# EAGLE design edgesata-v2 (EAGLE 6.4)
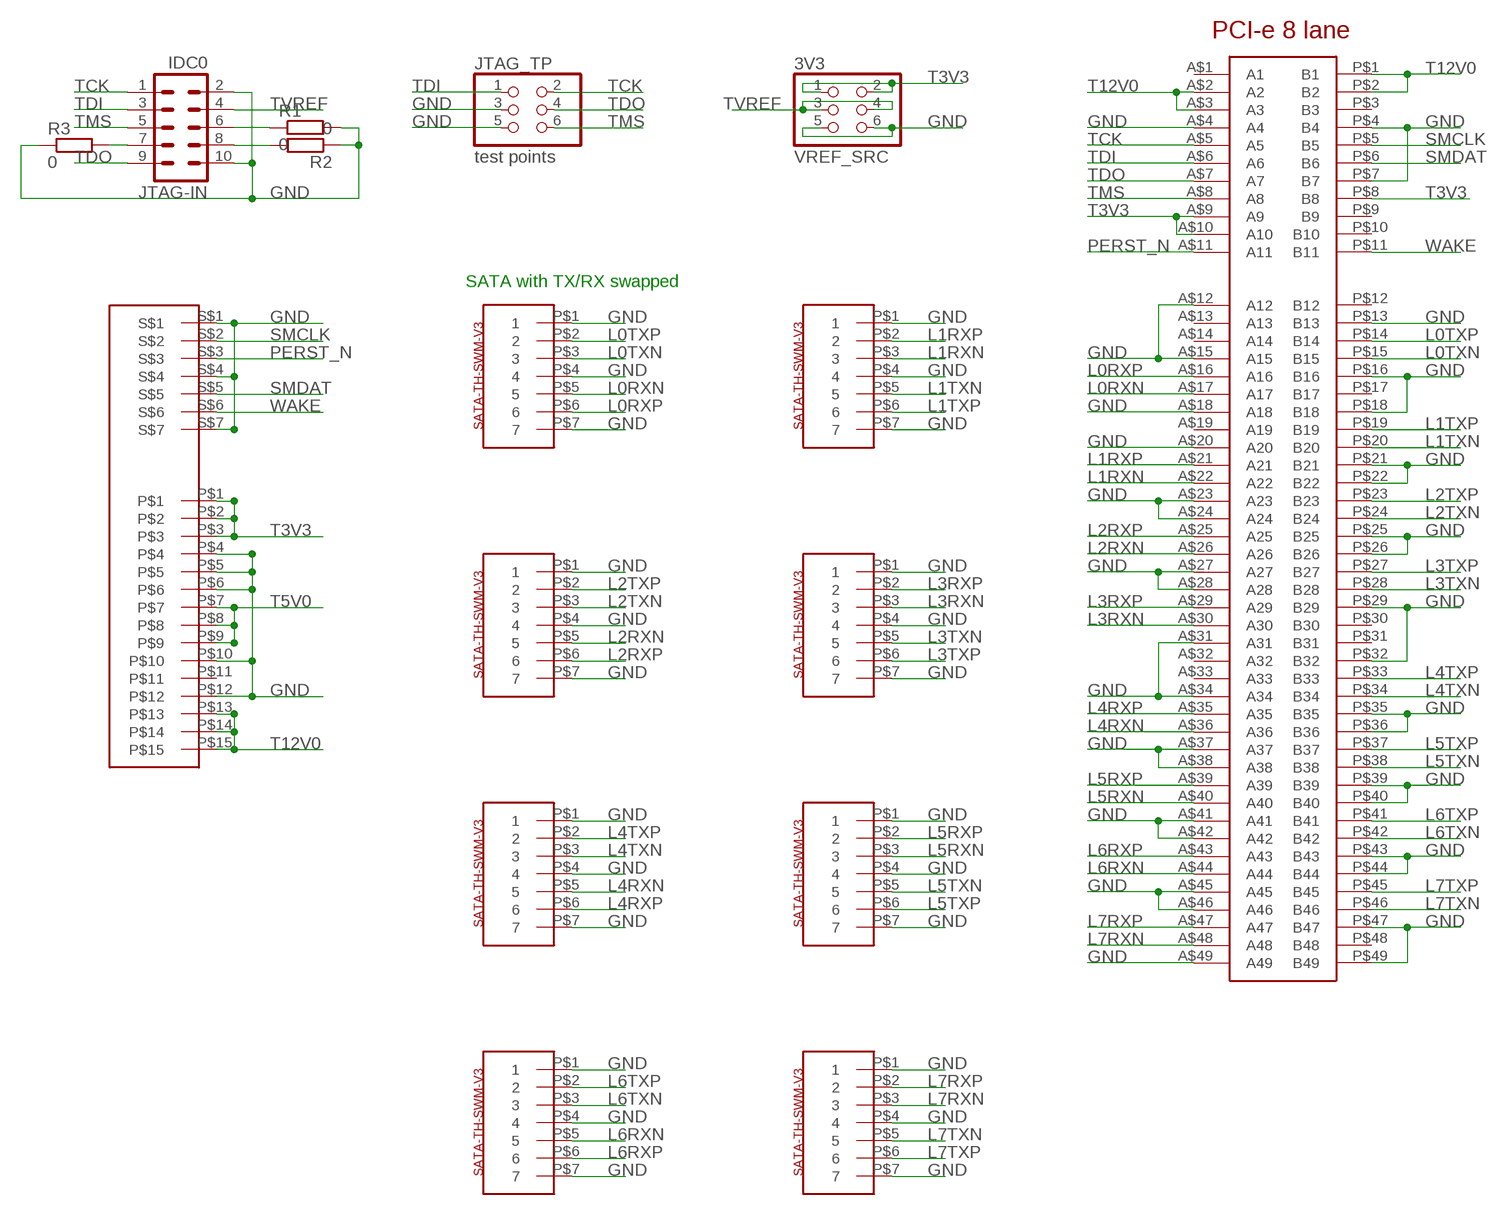
[diagram p0: schematic, sheet 1]

## Parts
3V3  VREF_SRC  PINHD-2X3  [2X03]
JTAG-IN  IDC0  MA05-2  [MA05-2]
JTAG_TP  test points  PINHD-2X3  [2X03]
LANE0  SATA-TH-SWM-V3  [SATA-TH-SWM-V3]
LANE1  SATA-TH-SWM-V3  [SATA-TH-SWM-V3]
LANE2  SATA-TH-SWM-V3  [SATA-TH-SWM-V3]
LANE3  SATA-TH-SWM-V3  [SATA-TH-SWM-V3]
LANE4  SATA-TH-SWM-V3  [SATA-TH-SWM-V3]
LANE5  SATA-TH-SWM-V3  [SATA-TH-SWM-V3]
LANE6  SATA-TH-SWM-V3  [SATA-TH-SWM-V3]
LANE7  SATA-TH-SWM-V3  [SATA-TH-SWM-V3]
R1  0  R-EU_R0805W  [R0805W]
R2  0  R-EU_R0805W  [R0805W]
R3  0  R-EU_R0805W  [R0805W]
U$1  SATA-POWER-V1  [SATA-POWER-V1]
U$8  PCIE-EDGE-8LANE-V1  [PCIE-EDGE-8LANE-V1]

## Nets
GND: 3V3.5 3V3.6 JTAG-IN.2 JTAG-IN.10 JTAG_TP.3 JTAG_TP.5 LANE0.P$1 LANE0.P$4 LANE0.P$7 LANE1.P$1 LANE1.P$4 LANE1.P$7 LANE2.P$1 LANE2.P$4 LANE2.P$7 LANE3.P$1 LANE3.P$4 LANE3.P$7 LANE4.P$1 LANE4.P$4 LANE4.P$7 LANE5.P$1 LANE5.P$4 LANE5.P$7 LANE6.P$1 LANE6.P$4 LANE6.P$7 LANE7.P$1 LANE7.P$4 LANE7.P$7 R1.2 R2.1 R3.1 U$1.P$4 U$1.P$5 U$1.P$6 U$1.P$10 U$1.P$12 U$1.S$1 U$1.S$4 U$1.S$7 U$8.A$4(A4) U$8.A$12(A12) U$8.A$15(A15) U$8.A$18(A18) U$8.A$20(A20) U$8.A$23(A23) U$8.A$24(A24) U$8.A$27(A27) U$8.A$28(A28) U$8.A$31(A31) U$8.A$34(A34) U$8.A$37(A37) U$8.A$38(A38) U$8.A$41(A41) U$8.A$42(A42) U$8.A$45(A45) U$8.A$46(A46) U$8.A$49(A49) U$8.P$4(B4) U$8.P$7(B7) U$8.P$13(B13) U$8.P$16(B16) U$8.P$18(B18) U$8.P$21(B21) U$8.P$22(B22) U$8.P$25(B25) U$8.P$26(B26) U$8.P$29(B29) U$8.P$32(B32) U$8.P$35(B35) U$8.P$36(B36) U$8.P$39(B39) U$8.P$40(B40) U$8.P$43(B43) U$8.P$44(B44) U$8.P$47(B47) U$8.P$49(B49)
L0RXN: LANE0.P$5 U$8.A$17(A17)
L0RXP: LANE0.P$6 U$8.A$16(A16)
L0TXN: LANE0.P$3 U$8.P$15(B15)
L0TXP: LANE0.P$2 U$8.P$14(B14)
L1RXN: LANE1.P$3 U$8.A$22(A22)
L1RXP: LANE1.P$2 U$8.A$21(A21)
L1TXN: LANE1.P$5 U$8.P$20(B20)
L1TXP: LANE1.P$6 U$8.P$19(B19)
L2RXN: LANE2.P$5 U$8.A$26(A26)
L2RXP: LANE2.P$6 U$8.A$25(A25)
L2TXN: LANE2.P$3 U$8.P$24(B24)
L2TXP: LANE2.P$2 U$8.P$23(B23)
L3RXN: LANE3.P$3 U$8.A$30(A30)
L3RXP: LANE3.P$2 U$8.A$29(A29)
L3TXN: LANE3.P$5 U$8.P$28(B28)
L3TXP: LANE3.P$6 U$8.P$27(B27)
L4RXN: LANE4.P$5 U$8.A$36(A36)
L4RXP: LANE4.P$6 U$8.A$35(A35)
L4TXN: LANE4.P$3 U$8.P$34(B34)
L4TXP: LANE4.P$2 U$8.P$33(B33)
L5RXN: LANE5.P$3 U$8.A$40(A40)
L5RXP: LANE5.P$2 U$8.A$39(A39)
L5TXN: LANE5.P$5 U$8.P$38(B38)
L5TXP: LANE5.P$6 U$8.P$37(B37)
L6RXN: LANE6.P$5 U$8.A$44(A44)
L6RXP: LANE6.P$6 U$8.A$43(A43)
L6TXN: LANE6.P$3 U$8.P$42(B42)
L6TXP: LANE6.P$2 U$8.P$41(B41)
L7RXN: LANE7.P$3 U$8.A$48(A48)
L7RXP: LANE7.P$2 U$8.A$47(A47)
L7TXN: LANE7.P$5 U$8.P$46(B46)
L7TXP: LANE7.P$6 U$8.P$45(B45)
N$1: JTAG-IN.7 R3.2
N$3: JTAG-IN.6 R1.1
N$5: JTAG-IN.8 R2.2
PERST_N: U$1.S$3 U$8.A$11(A11)
SMCLK: U$1.S$2 U$8.P$5(B5)
SMDAT: U$1.S$5 U$8.P$6(B6)
T3V3: 3V3.1 3V3.2 U$1.P$1 U$1.P$2 U$1.P$3 U$8.A$9(A9) U$8.A$10(A10) U$8.P$8(B8)
T5V0: U$1.P$7 U$1.P$8 U$1.P$9
T12V0: U$1.P$13 U$1.P$14 U$1.P$15 U$8.A$2(A2) U$8.A$3(A3) U$8.P$1(B1) U$8.P$2(B2)
TCK: JTAG-IN.1 JTAG_TP.2 U$8.A$5(A5)
TDI: JTAG-IN.3 JTAG_TP.1 U$8.A$6(A6)
TDO: JTAG-IN.9 JTAG_TP.4 U$8.A$7(A7)
TMS: JTAG-IN.5 JTAG_TP.6 U$8.A$8(A8)
TVREF: 3V3.3 3V3.4 JTAG-IN.4
WAKE: U$1.S$6 U$8.P$11(B11)
Unconnected: U$1.P$11 U$8.A$1(A1) U$8.A$13(A13) U$8.A$14(A14) U$8.A$19(A19) U$8.A$32(A32) U$8.A$33(A33) U$8.P$3(B3) U$8.P$9(B9) U$8.P$10(B10) U$8.P$12(B12) U$8.P$17(B17) U$8.P$30(B30) U$8.P$31(B31) U$8.P$48(B48)

## Notes on the sheet
- SATA with TX/RX swapped

## Library data of the parts
3V3 JTAG_TP = pinhead:PINHD-2X3: PIN HEADER
JTAG-IN = con-lstb:MA05-2: PIN HEADER
LANE0 LANE1-LANE7 = SATA-TH-SWM-V2:SATA-TH-SWM-V3
R1-R3 = rcl:R-EU_: RESISTOR, European symbol
U$1 = SATA-TH-SWM-V2:SATA-POWER-V1: SATA with power
U$8 = SATA-TH-SWM-V2:PCIE-EDGE-8LANE-V1

## Board
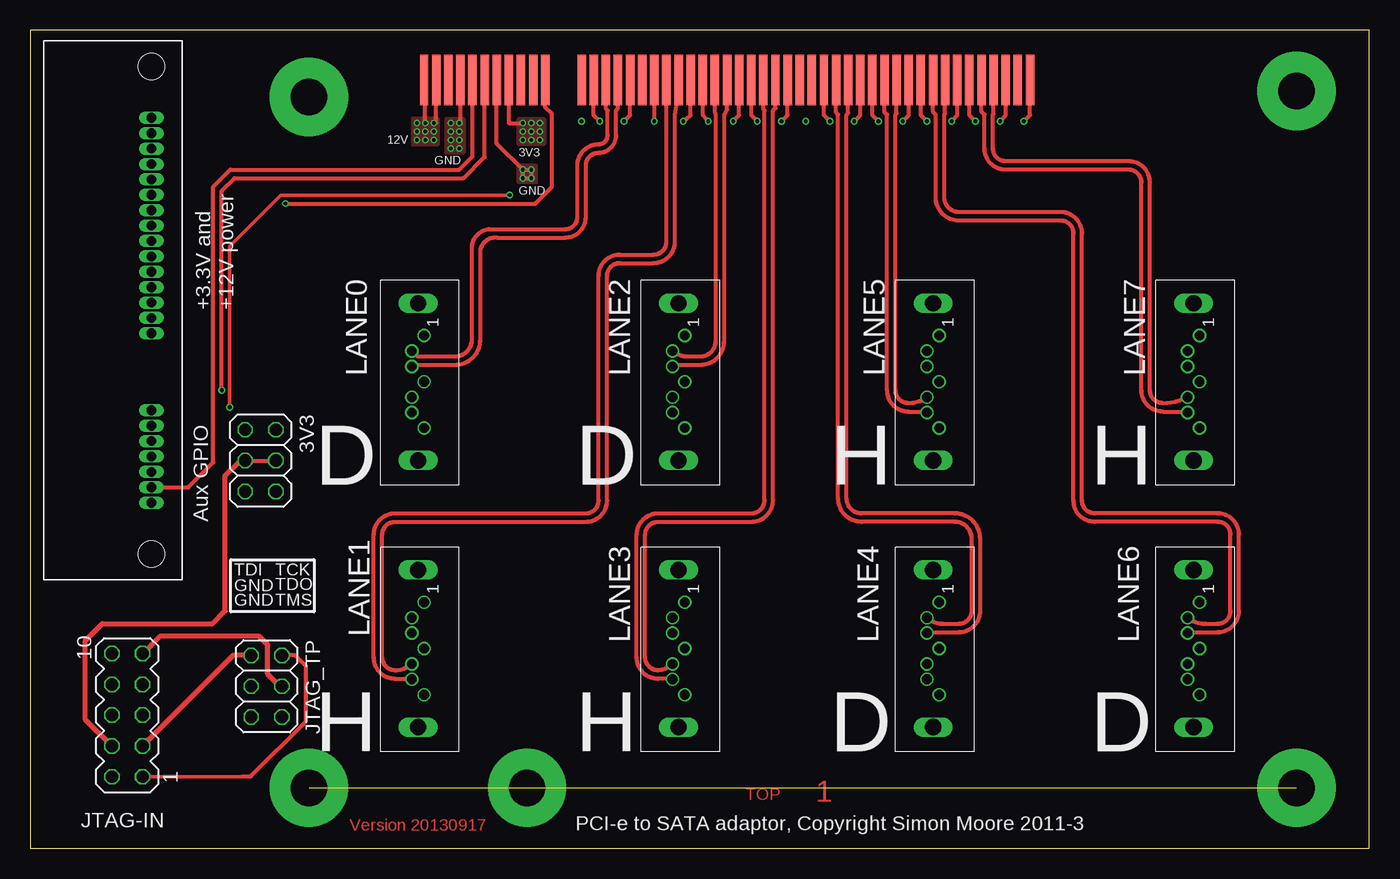
[diagram p1: board, top side]
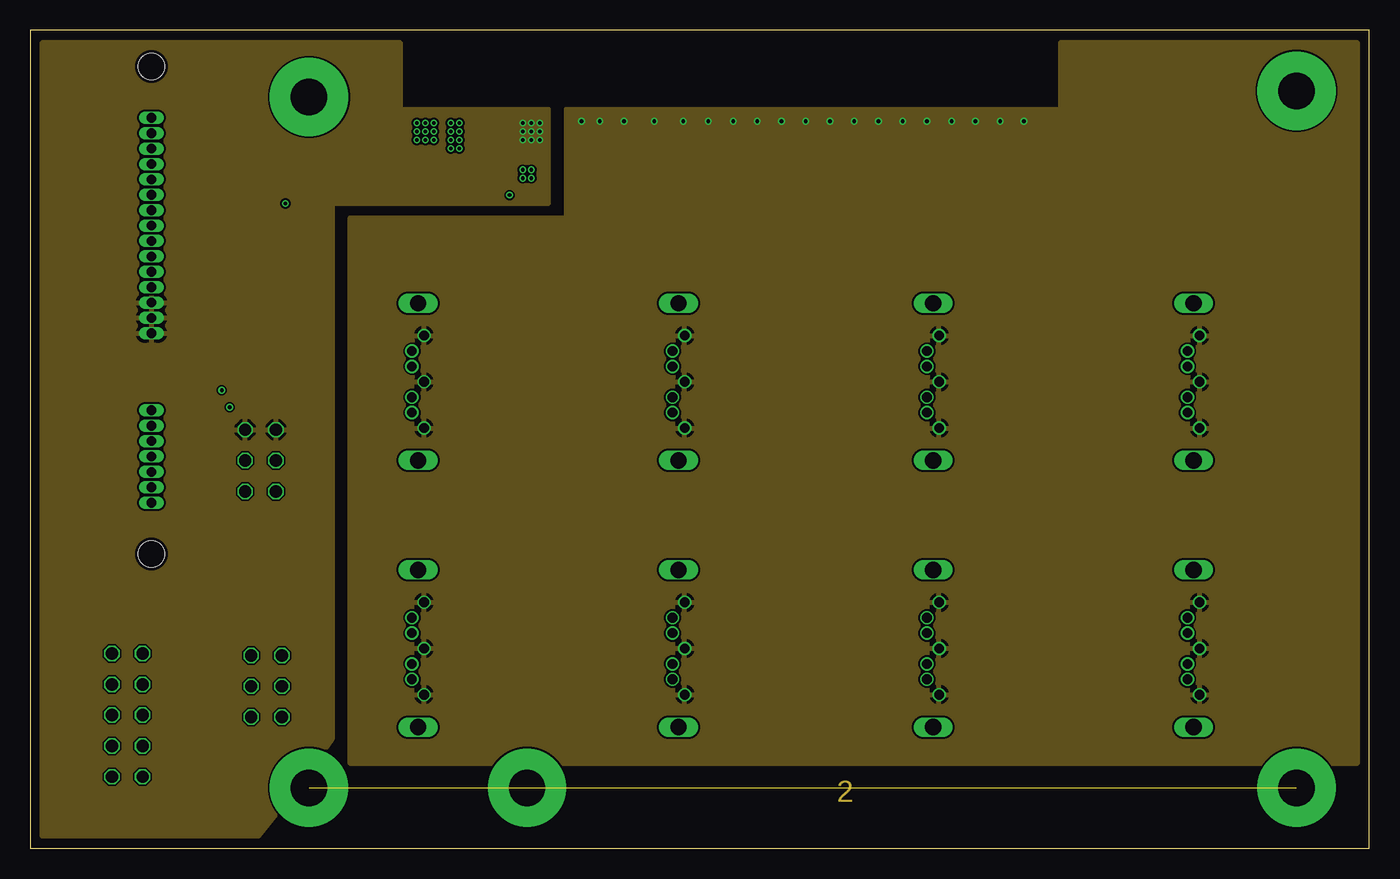
[diagram p2: board, inner layer Route2]
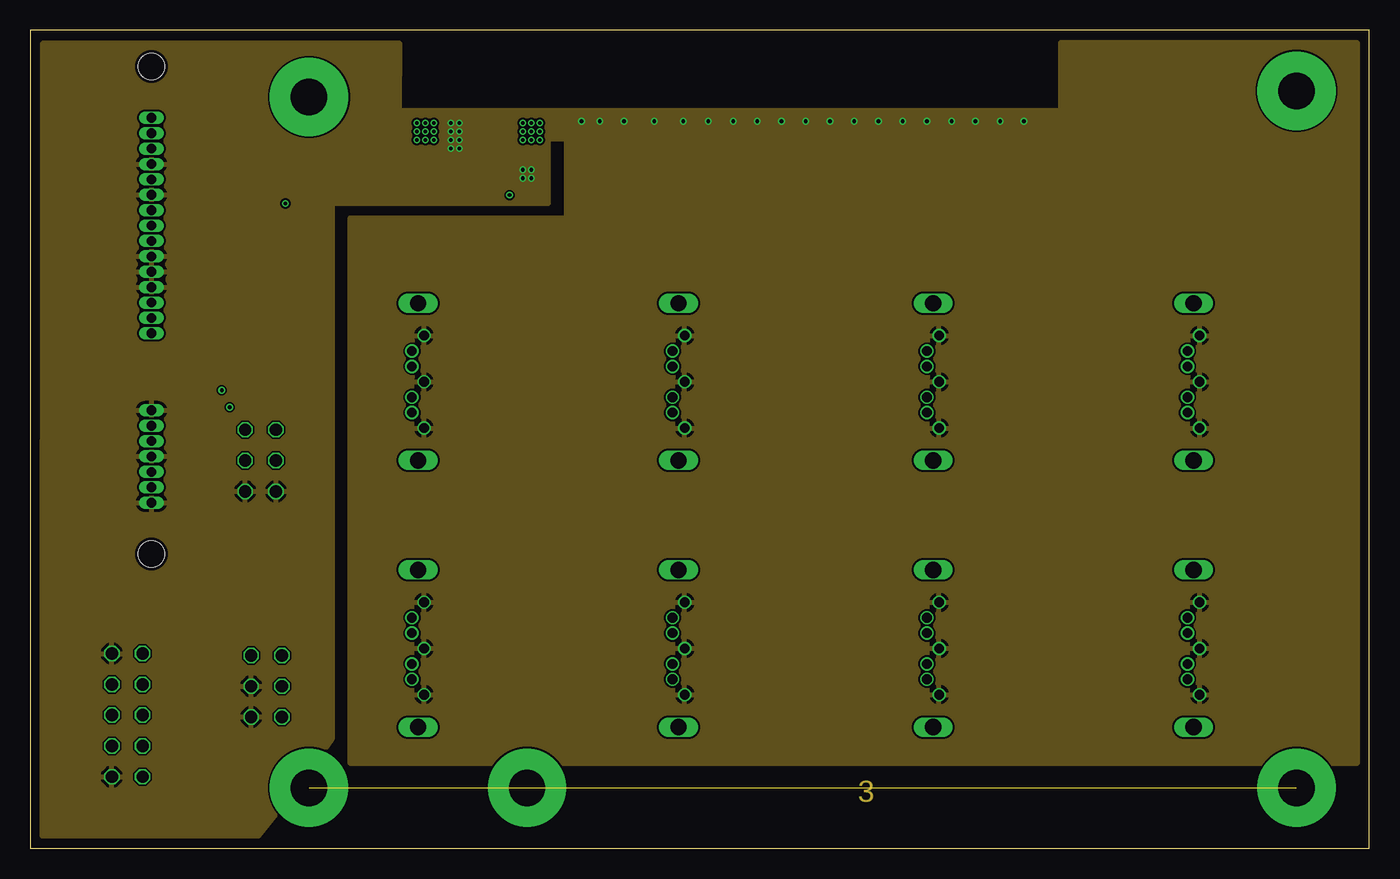
[diagram p3: board, inner layer Route15]
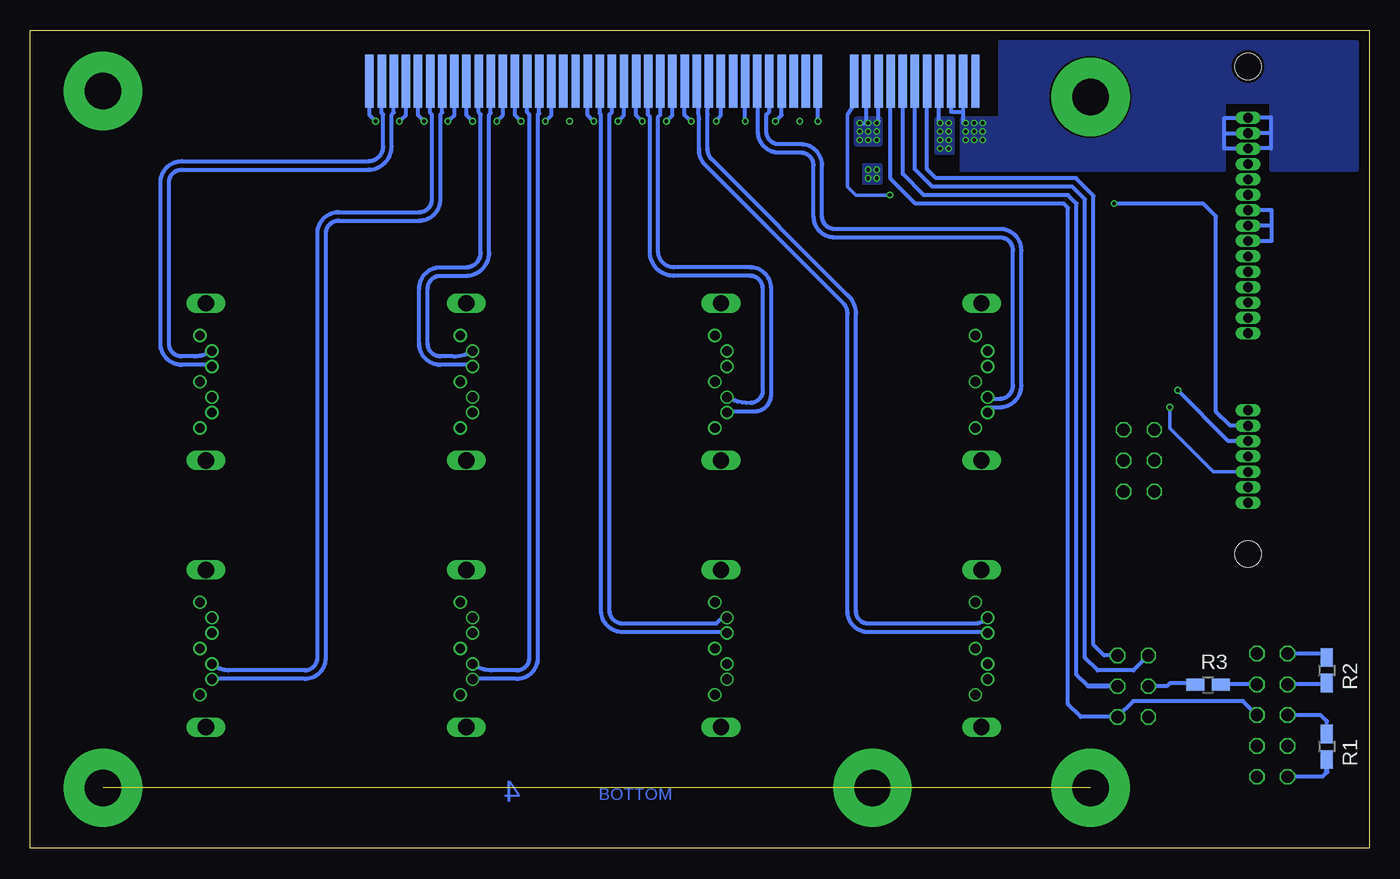
[diagram p4: board, bottom side, seen from below]

Size 110.5 x 67.5 mm. Coordinates in mm from the lower left corner, seen from the top.
Outline: 0,0 110.5,0 110.5,67.5 0,67.5 0,0
Copper layers (1*2+15*16): Top 0.035mm / dielectric 0.25mm / Route2 0.035mm / dielectric 1mm / Route15 0.035mm / dielectric 0.25mm / Bottom 0.035mm
Design rules "pcbtrain-SWM *": minimum track width 0.2mm, minimum drill 0.3mm, track to track 0.15mm, track to pad 0.15mm, pad to pad 0.15mm, via to via 0.15mm, smd to smd 0mil, copper to edge 10mil, drill to drill 0.2mm, minimum pad ring 0.125mm, minimum via ring 0.125mm, stop-mask expansion 0.125mm, vias tented up to drill 0mil, thermal gap 10mil

### Footprints (pad centres in the part's own frame; a part is rotated, then mirrored left to right if it is on the bottom)
2X03 = drill 1.016 octagon: 1 -2.54,-1.27; 2 -2.54,1.27; 3 0,-1.27; 4 0,1.27; 5 2.54,-1.27; 6 2.54,1.27
MA05-2 = drill 1.016 octagon: 1 -5.08,-1.27; 2 -5.08,1.27; 3 -2.54,-1.27; 4 -2.54,1.27; 5 0,-1.27; 6 0,1.27; 7 2.54,-1.27; 8 2.54,1.27; 9 5.08,-1.27; 10 5.08,1.27
SATA-TH-SWM-V3 = drill 1.35 long: M$1 -6.48,0; M$2 6.48,0 | drill 0.8 pad 1.1: P$1 3.81,-0.5; P$2 2.54,0.5; P$3 1.27,0.5; P$4 0,-0.5; P$5 -1.27,0.5; P$6 -2.54,0.5; P$7 -3.81,-0.5
R0805W = smd 1.5 x 1: 1 -1.052,0; 2 1.052,0
SATA-POWER-V1 = drill 0.8 pad 1.016 long: P$1 0,0; P$2 1.27,0; P$3 2.54,0; P$4 3.81,0; P$5 5.08,0; P$6 6.35,0; P$7 7.62,0; P$8 8.89,0; P$9 10.16,0; P$10 11.43,0; P$11 12.7,0; P$12 13.97,0; P$13 15.24,0; P$14 16.51,0; P$15 17.78,0; S$1 -13.97,0; S$2 -12.7,0; S$3 -11.43,0; S$4 -10.16,0; S$5 -8.89,0; S$6 -7.62,0; S$7 -6.35,0 | hole 2.2: -18.202,0; 22.013,0
PCIE-EDGE-8LANE-V1 = smd 0.7 x 4.4 bottom: A$1 -10,-2.2; A$2 -9,-2.2; A$3 -8,-2.2; A$4 -7,-2.2; A$5 -6,-2.2; A$6 -5,-2.2; A$7 -4,-2.2; A$8 -3,-2.2; A$9 -2,-2.2; A$10 -1,-2.2; A$11 0,-2.2; A$12 3,-2.2; A$13 4,-2.2; A$14 5,-2.2; A$15 6,-2.2; A$16 7,-2.2; A$17 8,-2.2; A$18 9,-2.2; A$19 10,-2.2; A$20 11,-2.2; A$21 12,-2.2; A$22 13,-2.2; A$23 14,-2.2; A$24 15,-2.2; A$25 16,-2.2; A$26 17,-2.2; A$27 18,-2.2; A$28 19,-2.2; A$29 20,-2.2; A$30 21,-2.2; A$31 22,-2.2; A$32 23,-2.2; A$33 24,-2.2; A$34 25,-2.2; A$35 26,-2.2; A$36 27,-2.2; A$37 28,-2.2; A$38 29,-2.2; A$39 30,-2.2; A$40 31,-2.2; A$41 32,-2.2; A$42 33,-2.2; A$43 34,-2.2; A$44 35,-2.2; A$45 36,-2.2; A$46 37,-2.2; A$47 38,-2.2; A$48 39,-2.2; A$49 40,-2.2 | smd 0.7 x 4.2: P$1 -10,-2.1; P$2 -9,-2.1; P$3 -8,-2.1; P$4 -7,-2.1; P$5 -6,-2.1; P$6 -5,-2.1; P$7 -4,-2.1; P$8 -3,-2.1; P$9 -2,-2.1; P$10 -1,-2.1; P$11 0,-2.1; P$12 3,-2.1; P$13 4,-2.1; P$14 5,-2.1; P$15 6,-2.1; P$16 7,-2.1; P$17 8,-2.1; P$18 9,-2.1; P$19 10,-2.1; P$20 11,-2.1; P$21 12,-2.1; P$22 13,-2.1; P$23 14,-2.1; P$24 15,-2.1; P$25 16,-2.1; P$26 17,-2.1; P$27 18,-2.1; P$28 19,-2.1; P$29 20,-2.1; P$30 21,-2.1; P$31 22,-2.1; P$32 23,-2.1; P$33 24,-2.1; P$34 25,-2.1; P$35 26,-2.1; P$36 27,-2.1; P$37 28,-2.1; P$38 29,-2.1; P$39 30,-2.1; P$40 31,-2.1; P$41 32,-2.1; P$42 33,-2.1; P$43 34,-2.1; P$44 35,-2.1; P$45 36,-2.1; P$46 37,-2.1; P$47 38,-2.1; P$48 39,-2.1; P$49 40,-2.1

### Placement (x,y rotation side)
3V3  19,32 270 top
JTAG-IN  8,11 90 top
JTAG_TP  19.5,13.39 270 top
LANE0  32,38.5 90 top
LANE1  32,16.5 90 top
LANE2  53.5,38.5 90 top
LANE3  53.5,16.5 90 top
LANE4  74.5,16.5 90 top
LANE5  74.5,38.5 90 top
LANE6  96,16.5 90 top
LANE7  96,38.5 90 top
R1  3.5,8.4 270 bottom
R2  3.5,14.7 270 bottom
R3  13.3,13.5 0 bottom
U$1  10,42.5 90 top
U$8  42.5,65.5 0 top

### Tracks (layer width: path | path; a pad name or v marks a point on that pad's centre or on a via)
GND  (via drill 0.3)
  Top 0.35: U$8.P$4 35.5,59.95 v35.4,59.85 | U$8.P$7 38.5,58.15 v40.65,56 | v40.65,56 v41.35,56 v41.35,55.3 v40.65,55.3 v40.65,56 | U$8.P$22 55.5,60.5 v55.95,60 | U$8.P$25 58.5,60.5 v58,60 | U$8.P$26 59.5,60.5 v60,60 | U$8.P$29 62.5,60.5 v62,60 | U$8.P$32 65.5,60.5 v66,60 | U$8.P$21 54.5,60.5 v53.9,60 | v51.5,60 U$8.P$18 | U$8.P$16 49.5,60.5 v49,60 | U$8.P$35 68.5,60.5 v68,60 | U$8.P$36 69.5,60.5 v70,60 | U$8.P$39 72.5,60.5 v72,60 | U$8.P$40 73.5,60.5 v74,60 | U$8.P$43 76.5,60.5 v76.05,60 | U$8.P$44 77.5,60.5 v78,60 | U$8.P$47 80.5,60.5 v80.05,60 | U$8.P$49 82.5,60.5 v82,60 | U$8.P$13 46.5,60.5 v47,60
  Bottom 0.35: U$8.A$4 35.5,59.95 v35.4,59.85 | v55.95,60 56.5,60.5 U$8.A$23 | U$8.A$24 57.5,60.5 v58,60 | U$8.A$27 60.5,60.5 v60,60 | U$8.A$28 61.5,60.5 v62,60 | U$8.A$31 64.5,60.5 v64,60 | U$8.A$20 53.5,60.5 v53.9,60 | v51.5,60 U$8.A$18 | U$8.A$15 48.5,60.5 v49,60 | U$8.A$34 67.5,60.5 v68,60 | U$8.A$37 70.5,60.5 v70,60 | U$8.A$38 71.5,60.5 v72,60 | U$8.A$41 74.5,60.5 v74,60 | U$8.A$42 75.5,60.5 v76.05,60 | U$8.A$45 78.5,60.5 v78,60 | U$8.A$46 79.5,60.5 v80.05,60 | U$8.P$49 U$8.A$49 82.5,60.5 v82,60 | v45.5,60 U$8.A$12 | R3.1 14.5,13.65 16.45,13.65 16.71,13.39 JTAG_TP.3 | 3.5,6.3 3.88,5.92 JTAG-IN.2 | JTAG-IN.10 3.83,16.08 R2.1
  Bottom 0.406: 3.5,6.3 R1.2
  other vias: 34.7,59.85 35.4,57.75 34.7,57.75 34.7,58.45 34.7,59.15 35.4,59.15 35.4,58.45
  pour Route15: 26.4,7 26.4,52.05 44.25,52.05 44.25,58.5 42.75,58.5 42.75,53.2 24.9,53.2 24.9,9 22.8,6 18.8,1 1,1 1.04,66.47 30.47,66.47 30.45,60.9 85.05,60.9 85.05,66.5 109.5,66.5 109.5,7
  pour Route2: 26.4,7 26.4,52.05 44.25,52.05 44.25,61 85.05,61 85.05,66.5 109.5,66.5 109.5,7
  pour Top: 34.35,60.2 35.75,60.2 35.75,57.4 34.35,57.4
  pour Bottom: 34.35,60.2 35.75,60.2 35.75,57.4 34.35,57.4
  pour Bottom: 40.3,56.35 41.7,56.35 41.7,54.95 40.3,54.95
  pour Top: 40.3,56.35 41.7,56.35 41.7,54.95 40.3,54.95
L0RXN
  Bottom 0.35: LANE0.P$5 arc-90 31.37,37.1 30.5,37.1 arc-90 29.4,38.2 29.4,49.35 arc-90 30.45,50.4 44.1,50.4 arc90 45.85,52.15 45.85,56.35 arc-90 46.9,57.4 48.7,57.4 arc90 50.45,59.15 50.45,60.55 U$8.A$17
L0RXP
  Bottom 0.35: U$8.A$16 49.5,60.8 49.75,60.55 49.75,59.15 arc-90 48.7,58.1 46.9,58.1 arc90 45.15,56.35 45.15,52.15 arc-90 44.1,51.1 30.45,51.1 arc90 28.7,49.35 28.7,38.2 arc90 30.5,36.4 31.06,36.4 arc-90 LANE0.P$6
L0TXN
  Top 0.35: U$8.P$15 48.5,61.05 48.35,60.9 48.35,58.85 arc-90 46.9,57.4 arc90 45.85,56.35 45.85,52.1 arc-90 44.15,50.4 38.55,50.4 arc90 37.15,49.35 37.15,42 arc-90 35.05,39.9 31.63,39.9 LANE0.P$3
L0TXP
  Top 0.35: U$8.P$14 47.5,61.05 47.65,60.9 47.65,58.85 arc-90 46.9,58.1 arc90 45.15,56.35 45.15,52.1 arc-90 44.15,51.1 37.85,51.1 arc90 36.45,49.35 36.45,42 arc-90 35.05,40.6 31.94,40.6 LANE0.P$2
L1RXN
  Bottom 0.35: LANE1.P$3 31.82,17.77 31.9,17.85 41.35,17.85 arc90 43.05,19.55 43.05,44.1 arc-43 43.4,45 54.95,56.55 arc41 55.3,57.75 55.3,60.2 U$8.A$22
L1RXP
  Bottom 0.35: LANE1.P$2 arc48 32.6,18.55 41.35,18.55 arc90 42.35,19.55 42.35,44.1 arc-49 43.05,45.65 54.25,56.85 arc48 54.6,57.75 54.6,60.55 U$8.A$21
L1TXN
  Top 0.35: U$8.P$20 53.55,62.65 53.2,60.55 53.2,50.05 arc-90 51.45,48.3 48.65,48.3 arc90 47.6,47.25 47.6,28.7 arc-90 45.85,26.95 30.1,26.95 arc90 29.05,25.9 29.05,15.75 arc90 30.1,14.7 arc41 LANE1.P$5
L1TXP
  Top 0.35: U$8.P$19 52.5,50.05 arc-90 51.45,49 48.65,49 arc90 46.9,47.25 46.9,28.7 arc-90 45.85,27.65 30.1,27.65 arc90 28.35,25.9 28.35,15.75 arc90 30.1,14 31.46,14 arc-90 LANE1.P$6
L2RXN
  Bottom 0.35: U$8.A$26 59.5,60.5 59.38,60.38 59.38,49.23 arc-90 57.4,47.25 51.1,47.25 arc90 50.05,46.2 50.05,37.8 arc90 51.1,36.75 arc28 LANE2.P$5
L2RXP
  Bottom 0.35: U$8.A$25 58.5,60.55 58.67,60.38 58.67,49.23 arc-90 57.4,47.95 51.1,47.95 arc90 49.35,46.2 49.35,37.45 arc90 50.75,36.05 52.91,36.05 arc-90 LANE2.P$6
L2TXN
  Top 0.35: U$8.P$24 57.5,60.95 57.27,60.55 57.27,41.88 arc-90 55.3,39.9 53.13,39.9 arc90 LANE2.P$3
L2TXP
  Top 0.35: U$8.P$23 56.5,60.8 56.58,60.55 56.58,41.88 arc-90 55.3,40.6 54.25,40.6 arc-39 LANE2.P$2
L3RXN
  Bottom 0.35: U$8.A$30 63.5,60.65 63.4,60.55 63.4,19.65 arc-90 61.6,17.85 53.08,17.85 arc90 LANE3.P$3
L3RXP
  Bottom 0.35: U$8.A$29 62.5,60.75 62.7,60.55 62.7,19.65 arc-90 61.6,18.55 53.9,18.55 53.55,18.9 53.14,18.9 LANE3.P$2
L3TXN
  Top 0.35: U$8.P$28 61.5,61.1 61.3,60.9 61.3,28.75 arc-90 59.5,26.95 51.8,26.95 arc90 50.75,25.9 50.75,15.75 arc90 51.8,14.7 arc48 LANE3.P$5
L3TXP
  Top 0.35: U$8.P$27 60.5,61 60.6,60.9 60.6,28.75 arc-90 59.5,27.65 51.8,27.65 arc90 50.05,25.9 50.05,15.75 arc90 51.8,14 52.61,14 arc-12 LANE3.P$6
L4RXN
  Bottom 0.35: U$8.A$36 69.5,60.75 69.3,60.55 69.3,15.75 arc90 70.35,14.7 72.45,14.7 arc38 LANE4.P$5
L4RXP
  Bottom 0.35: U$8.A$35 68.5,60.65 68.6,60.55 68.6,15.75 arc90 70.35,14 73.96,14 arc-90 LANE4.P$6
L4TXN
  Top 0.35: U$8.P$34 67.5,60.67 67.38,60.55 67.38,28.88 arc90 68.6,27.65 76.3,27.65 arc-90 78.4,25.55 78.4,19.6 arc-90 76.65,17.85 74.08,17.85 arc90 LANE4.P$3
L4TXP
  Top 0.35: U$8.P$33 66.5,60.73 66.67,60.55 66.67,28.88 arc90 68.6,26.95 76.3,26.95 arc-90 77.7,25.55 77.7,19.6 arc-90 76.65,18.55 75.25,18.55 arc-43 LANE4.P$2
L5RXN
  Bottom 0.35: U$8.A$40 73.5,60.73 73.33,60.55 73.33,49.17 arc90 74.55,47.95 76.65,47.95 arc-90 78.4,46.2 78.4,41.65 arc-90 76.65,39.9 74.13,39.9 arc90 LANE5.P$3
L5RXP
  Bottom 0.35: U$8.A$39 72.5,60.67 72.62,60.55 72.62,49.17 arc90 74.55,47.25 76.65,47.25 arc-90 77.7,46.2 77.7,41.65 arc-90 76.65,40.6 75.6,40.6 arc-31 LANE5.P$2
L5TXN
  Top 0.35: U$8.P$38 71.5,60.65 71.4,60.55 71.4,37.8 arc90 72.45,36.75 arc34 LANE5.P$5
L5TXP
  Top 0.35: U$8.P$37 70.5,60.75 70.7,60.55 70.7,37.8 arc90 72.45,36.05 73.91,36.05 arc-90 LANE5.P$6
L6RXN
  Bottom 0.35: U$8.A$44 77.5,60.7 77.35,60.55 77.35,53.55 arc90 78.4,52.5 85.05,52.5 arc-90 86.8,50.75 86.8,15.75 arc90 87.85,14.7 94.15,14.7 arc43 LANE6.P$5
L6RXP
  Bottom 0.35: U$8.A$43 76.5,60.7 76.65,60.55 76.65,53.55 arc90 78.4,51.8 85.05,51.8 arc-90 86.1,50.75 86.1,15.75 arc90 87.85,14 95.46,14 arc-90 LANE6.P$6
L6TXN
  Top 0.35: U$8.P$42 75.5,60.62 75.42,60.55 75.42,53.73 arc90 76.65,52.5 85.05,52.5 arc-90 86.8,50.75 86.8,28.7 arc90 87.85,27.65 98,27.65 arc-90 99.75,25.9 99.75,19.6 arc-90 98,17.85 95.58,17.85 arc90 LANE6.P$3
L6TXP
  Top 0.35: U$8.P$41 74.5,60.77 74.72,60.55 74.72,53.73 arc90 76.65,51.8 85.05,51.8 arc-90 86.1,50.75 86.1,28.7 arc90 87.85,26.95 98,26.95 arc-90 99.05,25.9 99.05,19.6 arc-90 98,18.55 96.95,18.55 arc-37 LANE6.P$2
L7RXN
  Bottom 0.35: U$8.A$48 81.5,60.67 81.38,60.55 81.38,57.92 arc90 82.6,56.7 98,56.7 arc-90 99.75,54.95 99.75,41.65 arc-90 98,39.9 95.63,39.9 arc90 LANE7.P$3
L7RXP
  Bottom 0.35: U$8.A$47 80.5,60.73 80.67,60.55 80.67,57.92 arc90 82.6,56 98,56 arc-90 99.05,54.95 99.05,41.65 arc-90 98,40.6 96.95,40.6 arc-34 LANE7.P$2
L7TXN
  Top 0.35: U$8.P$46 79.5,60.6 79.45,60.55 79.45,57.75 arc90 80.5,56.7 90.65,56.7 arc-90 92.4,54.95 92.4,37.8 arc90 93.45,36.75 arc26 LANE7.P$5
L7TXP
  Top 0.35: U$8.P$45 78.5,60.8 78.75,60.55 78.75,57.75 arc90 80.5,56 90.65,56 arc-90 91.7,54.95 91.7,37.8 arc90 93.45,36.05 95.41,36.05 arc-90 LANE7.P$6
N$1
  Bottom 0.35: R3.2 12.21,13.54 JTAG-IN.7
N$2  (via drill 3 pad 6.45)
  other vias: 23,62
N$3
  Bottom 0.35: JTAG-IN.6 4,11 3.5,10.5 R1.1
N$4  (via drill 3 pad 6.45)
  other vias: 104.5,62.5
N$5
  Bottom 0.35: JTAG-IN.8 3.61,13.54 R2.2
N$20  (via drill 3 pad 6.45)  (2 unrouted)
  other vias: 104.5,5 41,5 23,5
PERST_N  (via drill 0.3 pad 0.3)
  Top 0.305: v39.55,53.9 20.65,53.9 16.45,49.7 v16.45,36.4
  Bottom 0.305: U$8.A$11 42.5,61.45 43.05,60.55 43.05,54.6 42.35,53.9 v39.55,53.9 | U$1.S$3 12.87,31.07 16.45,34.65 v16.45,36.4
SMCLK
  Top 0.35: 36.45,63.4 U$8.P$5 36.5,57.1 35.4,56 16.5,56 15.1,54.6 15.1,31.85 13.05,29.8 U$1.S$2
SMDAT  (via drill 0.3)
  Top 0.35: U$8.P$6 37.5,57.05 35.75,55.3 16.85,55.3 15.8,54.25 v15.8,37.8
  Bottom 0.35: U$1.S$5 11.61,33.61 v15.8,37.8
T3V3  (via drill 0.3)
  Top 0.35: U$8.P$8 39.5,59.85 v40.65,59.85
  Bottom 0.35: v40.65,59.85 40.5,60 U$8.A$9 | U$8.A$10 41.5,59.85 v42.05,59.85
  other vias: 40.65,58.45 42.05,58.45 40.65,59.15 41.35,59.15 41.35,59.85 42.05,59.15 41.35,58.45
  pour Route2: 1,1 1,66.5 30.5,66.5 30.5,61 42.75,61 42.75,53.2 24.9,53.2 24.9,9 22.8,6 18.8,1
  pour Top: 40.3,60.2 42.4,60.2 42.4,58.1 40.3,58.1
  pour Top: 40.3,60.2 42.4,60.2 42.4,58.1 40.3,58.1
  pour Bottom: 40.3,58.1 40.3,60.2 42.4,60.2 42.4,58.1
T5V0
  Bottom 0.35: 8.05,51.39 8.05,50.12 U$1.P$7 | 8.05,51.39 U$1.P$8 | 8.05,51.39 8.05,52.66 U$1.P$9
T12V0  (via drill 0.3)
  Top 0.35: U$8.P$1 32.6,63.4 v32.6,59.85 | U$8.A$2 33.5,59.85 v33.3,59.85
  Top 0.7: U$8.A$2 U$8.P$2
  Bottom 0.35: U$1.P$15 11.95,60.28 11.95,59.01 | 11.95,59.01 U$1.P$14 | U$1.P$13 11.95,57.74 11.95,59.01 | 9.85,60.3 8.1,60.3 8.1,59 | 9.85,59.15 9.85,59 8.1,59 | 8.1,59 8.1,57.75 10.2,57.75 | 33.5,60.8 33.5,59.85 v33.3,59.85 | 33.5,60.8 U$8.A$2 | U$8.A$3 34.5,60.75 33.55,60.75 33.5,60.8
  other vias: 31.9,59.85 31.9,59.15 32.6,59.15 33.3,59.15 33.3,58.45 32.6,58.45 31.9,58.45
  pour Bottom: 11.95,56 11.95,61.95 30.5,62 30.5,60.2 33.65,60.2 33.65,56
  pour Bottom: 11.95,61.6 8.1,61.6 8.1,56 1,56 1,66.5 30.5,66.5 30.5,62 11.95,61.95
  pour Top: 31.55,60.2 31.55,58.1 33.65,58.1 33.65,60.2
TCK
  Top 0.35: JTAG-IN.1 17.5,5.95 18.2,5.95 22.75,10.5 22.75,15.05 21.87,15.93 JTAG_TP.2
  Bottom 0.35: U$8.A$5 36.5,56.05 35.75,55.3 24.2,55.3 22.75,53.85 22.75,16.8 21.88,15.93 JTAG_TP.2
TDI
  Top 0.406: JTAG_TP.1 16.74,15.93 JTAG-IN.3
  Bottom 0.35: U$8.A$6 37.5,56.05 36.05,54.6 24.5,54.6 23.45,53.55 23.45,15.75 22.4,14.7 19.46,14.7 JTAG_TP.1
TDO
  Top 0.35: 20.59,13.39 JTAG_TP.4
  Top 0.406: 20.59,13.39 19.6,14.38 19.6,16.8 18.9,17.5 10.69,17.5 JTAG-IN.9
  Bottom 0.35: U$8.A$7 38.5,55.65 36.75,53.9 24.85,53.9 24.15,53.2 24.15,14.35 23.19,13.39
  Bottom 0.406: JTAG_TP.4 23.19,13.39
TMS
  Bottom 0.35: U$8.A$8 39.5,55.25 37.45,53.2 25.2,53.2 24.85,52.85 24.85,11.9 23.8,10.85 JTAG_TP.6 | JTAG_TP.6 20.65,10.85 | JTAG-IN.5 10.42,12.15 19.35,12.15 19.47,12.15 JTAG_TP.6
TVREF
  Top 0.35: 3V3.3 3V3.4
  Top 0.406: JTAG-IN.4 4.55,10.64 4.55,17.15 5.95,18.55 15.05,18.55 16.1,19.6 16.1,30.8 17.3,32 3V3.3
WAKE  (via drill 0.3)
  Top 0.35: 42.4,63.4 U$8.P$11 42.5,61.15 43.05,60.6 43.05,54.6 41.7,53.25 41.7,53.2 v21.05,53.2
  Bottom 0.35: U$1.S$6 11.48,34.88 12.65,36.05 12.65,52.15 13.7,53.2 v21.05,53.2

### Text on the board
Top: TOP | 1 | Version 20130917
Route2: 2
Route15: 3
Bottom: BOTTOM | 4
tPlace: 12V | 3V3 | GND | GND
tNames: LANE0 | +3.3V and / +12V power | LANE2 | LANE5 | LANE7 | D | D | H | H | Aux GPIO | TDI | TCK | GND | TDO | GND | TMS | LANE1 | LANE3 | LANE4 | LANE6 | H | H | D | D | PCI-e to SATA adaptor, Copyright Simon Moore 2011-3